# Altium schematic sheet HIC15.SchDoc
size B; Organization: Altium Limited; Address1: L3, 12a Rodborough Rd; Address2: Frenchs Forest; Address3: NSW; Address4: Australia 2086
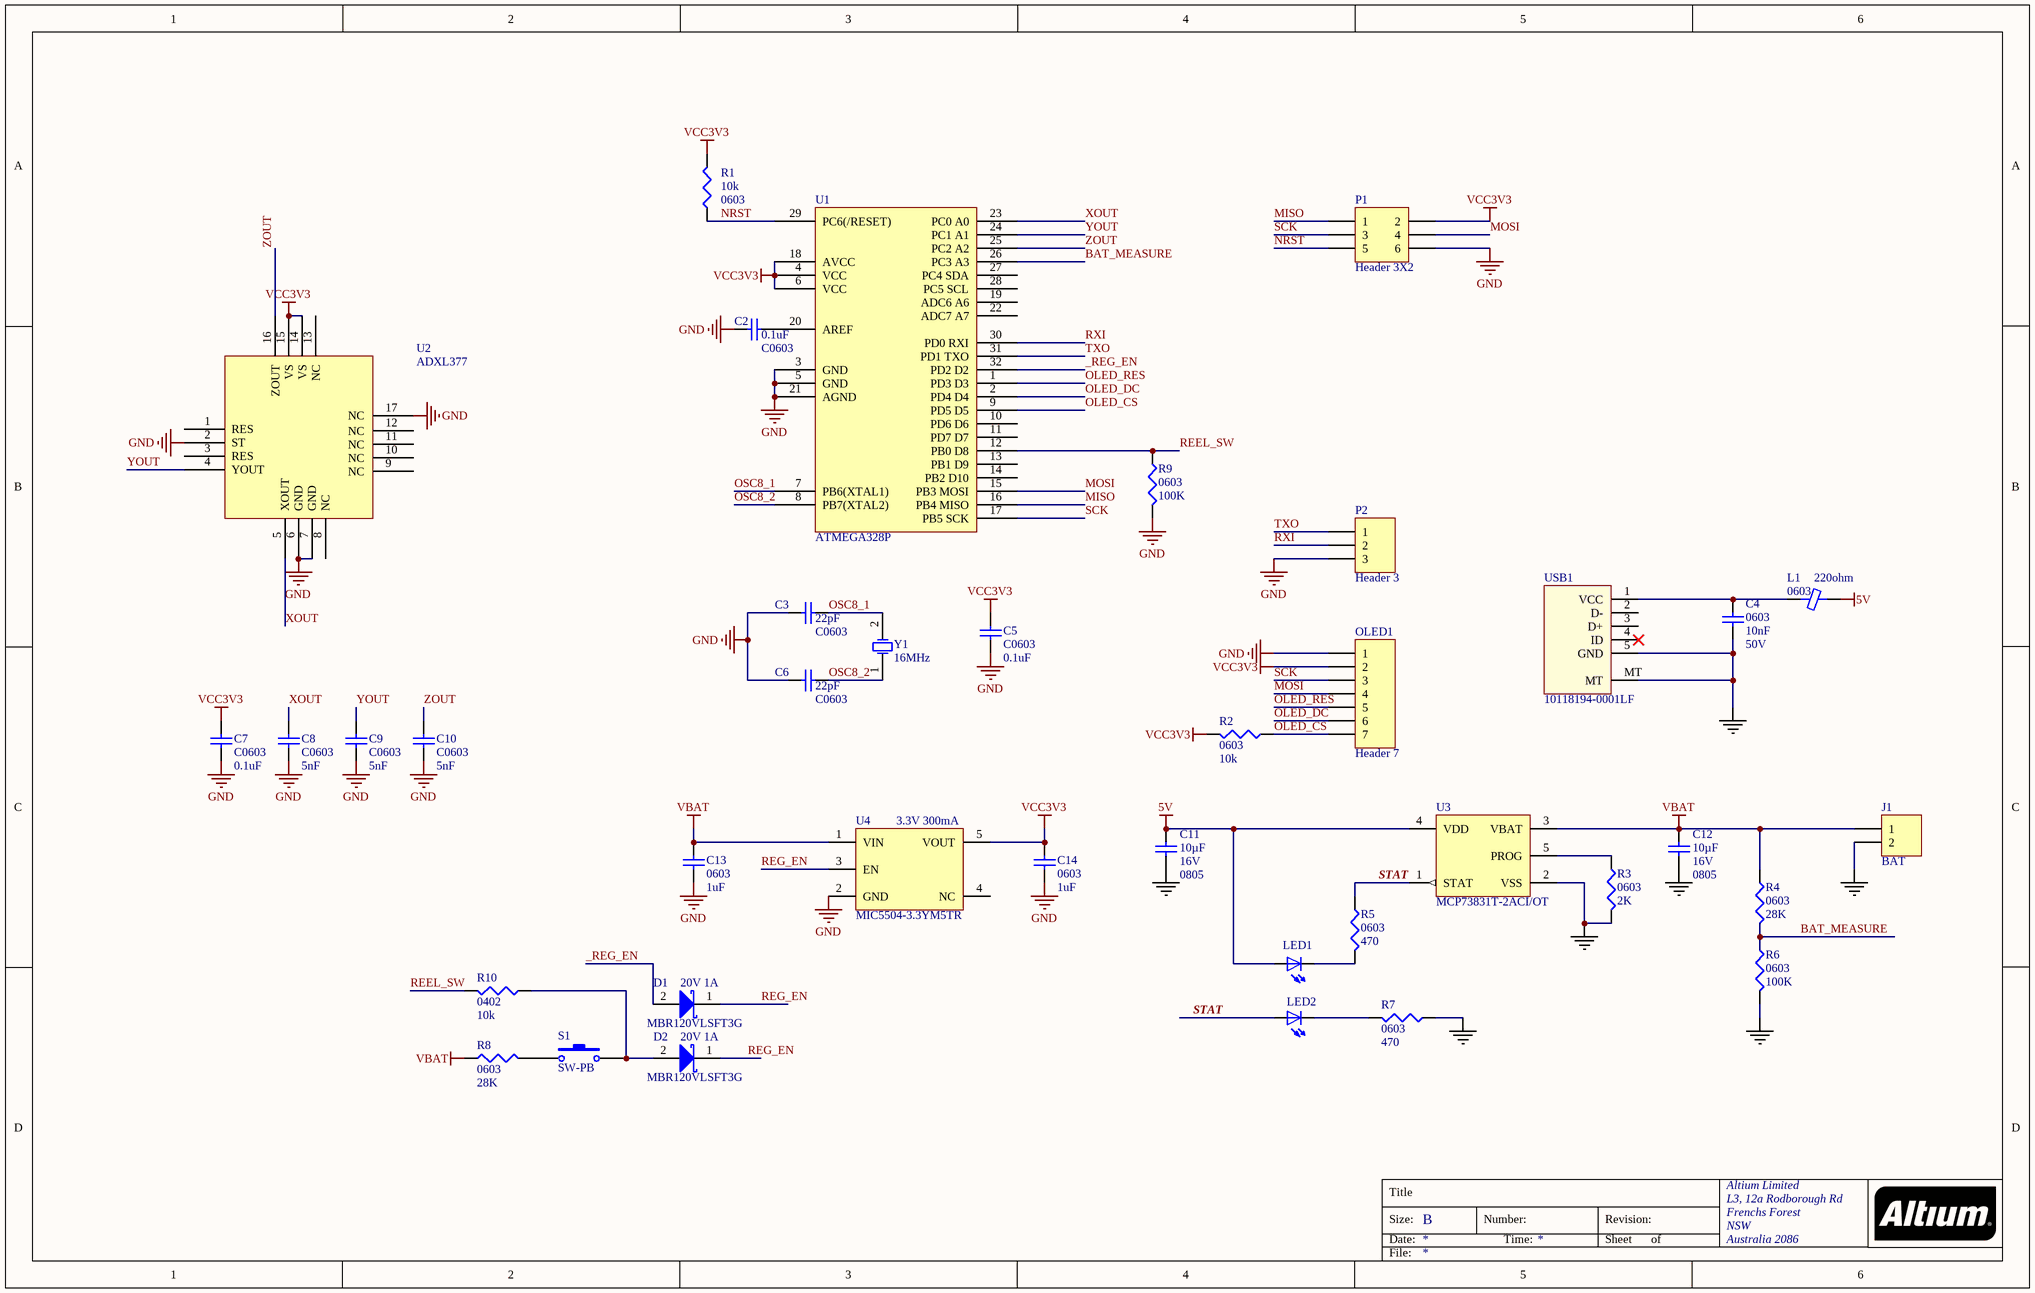
[diagram p0: HIC15.SchDoc]

## Parts
C2  C0603  value 0.1uF  [C0603]
C3  C0603  value 22pF  [C0603]
C4  0603  value 10nF  Voltage Rating: 50V  [C0603]
C5  C0603  value 0.1uF  [C0603]
C6  C0603  value 22pF  [C0603]
C7  C0603  value 0.1uF  [C0603]
C8  C0603  value 5nF  [C0603]
C9  C0603  value 5nF  [C0603]
C10  C0603  value 5nF  [C0603]
C11  0805  value 10µF  Voltage - Rated: 16V  [C0805]
C12  0805  value 10µF  Voltage - Rated: 16V  [C0805]
C13  0603  value 1uF  [C0603]
C14  0603  value 1uF  [C0603]
D1  MBR120VLSFT3G  value 20V 1A  [SOD-123FL]
D2  MBR120VLSFT3G  value 20V 1A  [SOD-123FL]
J1  BAT  [HDR1X2]
L1  0603  value 220ohm  [FER 0603/1608]
LED1  LTST-C190KRKT  [LED-0603-RED]  (value not drawn)
LED2  LTST-C190KGKT  [LED-0603-GREEN]  (value not drawn)
OLED1  Header 7  [CON-7]
P1  Header 3X2  [SPI_PORT]
P2  Header 3  [HDR1X3]
R1  0603  value 10k  [R0603]
R2  0603  value 10k  [R0603]
R3  0603  value 2K  [R0603]
R4  0603  value 28K  [R0603]
R5  0603  value 470  [R0603]
R6  0603  value 100K  [R0603]
R7  0603  value 470  [R0603]
R8  0603  value 28K  [R0603]
R9  0603  value 100K  [R0603]
R10  0402  value 10k  [R0402]
S1  SW-PB  [REED_SWITCH]
U1  ATMEGA328P  [32A-M]
U2  ADXL377  [QFN50P300X300X150_HS-17L]
U3  MCP73831T-2ACI/OT  [SOT23-5]
U4  MIC5504-3.3YM5TR  value 3.3V 300mA  [SOT23-5]
USB1  10118194-0001LF  [10118194-0001LF]
Y1  16MHz  [ABM3]

## Nets
5V: C11.2 L1.1 LED1.A U3.4(VDD)
GND: C2.2 C3.2 C4.1 C5.2 C6.2 C7.2 C8.2 C9.2 C10.2 C11.1 C12.1 C13.1 C14.1 J1.2 OLED1.1 P1.6 P2.3 R3.2 R6.2 R7.1 R9.2 U1.3(GND) U1.5(GND) U1.21(AGND) U2.2(ST) U2.6(GND) U2.7(GND) U2.17(NC) U3.2(VSS) U4.2(GND) USB1.5(GND) USB1.MT
VBAT: C12.2 C13.2 J1.1 R4.1 R8.1 U3.3(VBAT) U4.1(VIN)
VCC3V3: C5.1 C7.1 C14.2 OLED1.2 P1.2 R1.2 R2.2 U1.4(VCC) U1.6(VCC) U1.18(AVCC) U2.14(VS) U2.15(VS) U4.5(VOUT)
_REG_EN: D1.2(K) U1.32(PD2_D2)
BAT_MEASURE: R4.2 R6.1 U1.26(PC3_A3)
MISO: P1.1 U1.16(PB4_MISO)
MOSI: OLED1.4 P1.4 U1.15(PB3_MOSI)
NRST: P1.5 R1.1 U1.29(PC6(/RESET))
OLED_CS: OLED1.7 R2.1 U1.9(PD5_D5)
OLED_DC: OLED1.6 U1.2(PD4_D4)
OLED_RES: OLED1.5 U1.1(PD3_D3)
OSC8_1: C3.1 U1.7(PB6(XTAL1)) Y1.2(OSC2)
OSC8_2: C6.1 U1.8(PB7(XTAL2)) Y1.1(OSC1)
REEL_SW: R9.1 R10.2 U1.12(PB0_D8)
REG_EN: D1.1(A) D2.1(A) U4.3(EN)
RXI: P2.2 U1.30(PD0_RXI)
SCK: OLED1.3 P1.3 U1.17(PB5_SCK)
STAT: LED2.A R5.1 U3.1(STAT)
TXO: P2.1 U1.31(PD1_TXO)
XOUT: C8.1 U1.23(PC0_A0) U2.5(XOUT)
YOUT: C9.1 U1.24(PC1_A1) U2.4(YOUT)
ZOUT: C10.1 U1.25(PC2_A2) U2.16(ZOUT)
NetC2_1: C2.1 U1.20(AREF)
NetC4_2: C4.2 L1.2 USB1.1(VCC)
NetD2_2: D2.2(K) R10.1 S1.2
NetLED1_C: LED1.C R5.2
NetLED2_C: LED2.C R7.2
NetR3_1: R3.1 U3.5(PROG)
NetR8_2: R8.2 S1.1

Not connected (* = marked no-connect by the designer): U1 10(PD6_D6) 11(PD7_D7) 13(PB1_D9) 14(PB2_D10) 19(ADC6_A6) 22(ADC7_A7) 27(PC4_SDA) 28(PC5_SCL); U2 1(RES) 3(RES) 8(NC) 9(NC) 10(NC) 11(NC) 12(NC) 13(NC); U4 4(NC); USB1 2(D-) 3(D+) 4(ID)*

## Notes on the sheet
- Title
- Size:
- Date:
- B
- Number:
- Time:
- Revision:
- Sheet
- of
- File:

## Library data of the parts
C2 C3 C5-C10 = Cap_0603: Capacitor
C4 = Cap Semi: CAP CER 10000PF 50V X7R 0402; Manufacturer: Murata; Manufacturer Part Number: GCM155R71H103KA55D; Tolerance: 10%; ComponentLink1URL: http://www.murata.com/~/media/webrenewal/support/library/catalog/products/capacitor/mlcc/c02e.pdf; ComponentLink1Description: http://www.murata.com/~/media/webrenewal/support/library/catalog/products/capacitor/mlcc/c02e.pdf; ComponentLink2URL: https://datasheet.ciiva.com/16208/cl05b104kq5nnnc-16208343.pdf; ComponentLink2Description: https://datasheet.ciiva.com/16208/cl05b104kq5nnnc-16208343.pdf; ComponentLink3URL: https://datasheet.ciiva.com/26920/getdatasheetpartid-359683-26920169.pdf; ComponentLink3Description: https://datasheet.ciiva.com/26920/getdatasheetpartid-359683-26920169.pdf; ComponentLink4URL: https://datasheet.ciiva.com/26309/mlcc-catalogdownload2013-eng-26309003.pdf; ComponentLink4Description: https://datasheet.ciiva.com/26309/mlcc-catalogdownload2013-eng-26309003.pdf; ComponentLink5URL: https://datasheet.ciiva.com/29198/458718-da-01-en-vs-kondensator-0402-29198423.pdf; ComponentLink5Description: https://datasheet.ciiva.com/29198/458718-da-01-en-vs-kondensator-0402-29198423.pdf; Supplier 1: Digi-Key; Supplier Part Number 1: 490-4762-1-ND; Stock 1: 100000; Pricing 1: 1=0.1, 10=0.048, 100=0.0215, 500=0.01538, 1000=0.01208, 2500=0.01098, 5000=0.0101 (USD); Mount: Surface Mount; Case/Package: 0402; Case Code (Imperial): 0402; Case Code (Metric): 1005; Min Operating Temperature: -55°C; Max Operating Temperature: 125°C; Capacitance: 10nF; Dielectric: X7R; Packaging: Tape and Reel; Package Quantity: 1; Termination: SMD/SMT; Voltage: 50V; Voltage Rating (DC): 50V; Length: 1mm; Height: 0.5mm; Width: 0.02inch; Thickness: 0.022inch; Depth: 0.5mm; Ratings: AEC-Q200; Radiation Hardening: No; REACH SVHC: No SVHC; Lead Free: Lead Free; ComponentLink6URL: https://datasheet.ciiva.com/16199/product-16199584.pdf; ComponentLink6Description: https://datasheet.ciiva.com/16199/product-16199584.pdf; ComponentLink7URL: https://datasheet.ciiva.com/18100/getdatasheetpartid-27433-18100656.pdf; ComponentLink7Description: https://datasheet.ciiva.com/18100/getdatasheetpartid-27433-18100656.pdf; ComponentLink8URL: https://datasheet.ciiva.com/130/product-130682.pdf; ComponentLink8Description: https://datasheet.ciiva.com/130/product-130682.pdf; ComponentLink9URL: https://datasheet.ciiva.com/11787/0900766b80ef92d0-11787082.pdf; ComponentLink9Description: https://datasheet.ciiva.com/11787/0900766b80ef92d0-11787082.pdf; ComponentLink10URL: https://datasheet.ciiva.com/130/product-130683.pdf; ComponentLink10Description: https://datasheet.ciiva.com/130/product-130683.pdf; ComponentLink11URL: https://datasheet.ciiva.com/130/product-130684.pdf; ComponentLink11Description: https://datasheet.ciiva.com/130/product-130684.pdf; ComponentLink12URL: https://datasheet.ciiva.com/2989/product-2989235.pdf; ComponentLink12Description: https://datasheet.ciiva.com/2989/product-2989235.pdf; ComponentLink13URL: https://datasheet.ciiva.com/16624/product-16624550.pdf; ComponentLink13Description: https://datasheet.ciiva.com/16624/product-16624550.pdf
C11 C12 = Cap Semi: CAP CER 10UF 16V X5R 0805; Manufacturer: Murata Electronics North America; Manufacturer Part Number: GRM21BR61C106KE15K; Tolerance: ±10%; Supplier 1: Digi-Key; Supplier Part Number 1: 490-6473-1-ND; RoHS: RoHS Compliant; Category: Capacitors; Stock 1: 129274; Pricing 1: 1=0.19, 10=0.13, 50=0.0748, 100=0.0618, 250=0.052, 500=0.04356, 1000=0.03575, 5000=0.03023 (USD); Packaging: Cut Tape (CT); Capacitance: 10µF; Temperature Coefficient: X5R; Mounting Type: Surface Mount, MLCC; Operating Temperature: -55°C ~ 85°C; Applications: General Purpose; Ratings: -; Package / Case: 0805 (2012 Metric); Size / Dimension: 0.079" L x 0.049" W (2.00mm x 1.25mm); Height - Seated (Max): -; Thickness (Max): 0.053" (1.35mm); Lead Spacing: -; Features: -; Lead Style: -; ComponentLink1URL: http://www.murata.com/~/media/webrenewal/support/library/catalog/products/capacitor/mlcc/c02e.pdf; ComponentLink1Description: http://www.murata.com/~/media/webrenewal/support/library/catalog/products/capacitor/mlcc/c02e.pdf
C13 C14 = Cap: Capacitor; Published: 8-Jun-2000; LatestRevisionDate: 17-Jul-2002; LatestRevisionNote: Re-released for DXP Platform.; PackageReference: RAD-0.3; Publisher: Altium Limited; PackageDescription: Radial Cap, Thru-Hole; 2 Leads; 0.3 in Pin Spacing
D1 D2 = D Schottky: DIODE SCHOTTKY 20V 1A SOD123FL; Manufacturer: ON Semiconductor; Max Surge Current: 45A; Forward Voltage: 340mV; Peak Reverse Current: 600uA; Element Configuration: Single; Polarity: Standard; ComponentLink1URL: http://www.onsemi.com/pub_link/Collateral/MBR0520LT1-D.PDF; ComponentLink1Description: http://www.onsemi.com/pub_link/Collateral/MBR0520LT1-D.PDF; Supplier 1: Digi-Key; Supplier Part Number 1: MBR120VLSFT3GOSCT-ND; Manufacturer Part Number: MBR120VLSFT3G; Stock 1: 46165; Pricing 1: 1=0.42, 10=0.338, 100=0.2298, 500=0.17234, 1000=0.12926 (USD); Number of Pins: 2; Min Operating Temperature: -65°C; Max Operating Temperature: 125°C; Package Quantity: 10000; Forward Current: 1A; Packaging: Tape and Reel; Max Reverse Leakage Current: 600uA; Average Rectified Current: 1A; Peak Non-Repetitive Surge Current: 45A; Max Repetitive Reverse Voltage (Vrrm): 20V; Max Forward Surge Current (Ifsm): 45A; Voltage Rating (DC): 20V; Current Rating: 1A; Output Current: 1A; Max Reverse Voltage (DC): 20V; Radiation Hardening: No; REACH SVHC: No SVHC; Lead Free: Lead Free; Halogen Free: Halogen Free; ComponentLink2URL: https://datasheet.ciiva.com/4715/mbr120vlsft1-d-107081-4715104.pdf; ComponentLink2Description: https://datasheet.ciiva.com/4715/mbr120vlsft1-d-107081-4715104.pdf; ComponentLink3URL: https://datasheet.ciiva.com/6380/mbr120vlsft1-d-6380907.pdf; ComponentLink3Description: https://datasheet.ciiva.com/6380/mbr120vlsft1-d-6380907.pdf; ComponentLink4URL: https://datasheet.ciiva.com/8294/mbr120vlsft1-d-8294603.pdf; ComponentLink4Description: https://datasheet.ciiva.com/8294/mbr120vlsft1-d-8294603.pdf; ComponentLink5URL: https://datasheet.ciiva.com/6380/mbr120vlsft1-d-6380910.pdf; ComponentLink5Description: https://datasheet.ciiva.com/6380/mbr120vlsft1-d-6380910.pdf
J1 = Header 2: Header, 2-Pin; LatestRevisionDate: 17-Jul-2002; LatestRevisionNote: Re-released for DXP Platform.; Publisher: Altium Limited
L1 = Ferrite Chip: FERRITE BEAD 220 OHM 0603 1LN; Manufacturer: Murata; Manufacturer Part Number: BLM18EG221SN1D; Material: Steel,Ferrite; Tolerance: 25%; Impedance: 220R; DC Resistance (DCR): 50mR; Max DC Current: 2A; Number of Lines: 1; Test Frequency: 100MHz; ComponentLink1URL: http://components.arrow.com/part/dataview/0323_06096831; ComponentLink1Description: http://components.arrow.com/part/dataview/0323_06096831; ComponentLink2URL: http://www.murata.com/en-us/products/productdata/8796740354078/QNFA9102.pdf; ComponentLink2Description: http://www.murata.com/en-us/products/productdata/8796740354078/QNFA9102.pdf; ComponentLink3URL: http://search.murata.co.jp/Ceramy/image/img/PDF/ENG/L0132S0193BLM21P.pdf; ComponentLink3Description: http://search.murata.co.jp/Ceramy/image/img/PDF/ENG/L0132S0193BLM21P.pdf; ComponentLink4URL: http://www.mouser.com/ds/2/281/c31e-794748.pdf; ComponentLink4Description: http://www.mouser.com/ds/2/281/c31e-794748.pdf; ComponentLink5URL: https://datasheet.ciiva.com/46634/beads-commercial-power-mpz-en-46634741.pdf; ComponentLink5Description: https://datasheet.ciiva.com/46634/beads-commercial-power-mpz-en-46634741.pdf; ComponentLink6URL: https://datasheet.ciiva.com/46634/beads-commercial-power-mpz-en-46634632.pdf; ComponentLink6Description: https://datasheet.ciiva.com/46634/beads-commercial-power-mpz-en-46634632.pdf; ComponentLink7URL: https://datasheet.ciiva.com/46634/beads-commercial-power-mpz-en-46634712.pdf; ComponentLink7Description: https://datasheet.ciiva.com/46634/beads-commercial-power-mpz-en-46634712.pdf; ComponentLink8URL: https://datasheet.ciiva.com/48682/beads-commercial-power-mpz-en-48682492.pdf; ComponentLink8Description: https://datasheet.ciiva.com/48682/beads-commercial-power-mpz-en-48682492.pdf; Supplier 1: Digi-Key; Supplier Part Number 1: 490-3992-1-ND; Stock 1: 618017; Pricing 1: 1=0.23, 10=0.175, 25=0.1452, 50=0.1252, 100=0.1126, 250=0.09508, 500=0.08508, 1000=0.07257 (USD); Case/Package: 0603; Number of Pins: 2; Core Material: Ferrite; Case Code (Metric): 1608; Case Code (Imperial): 0603; Contact Plating: Tin,Matte; Min Operating Temperature: -55°C; Max Operating Temperature: 125°C; Resistance: 50mR; Package Quantity: 1; Packaging: Tape and Reel; Current Rating: 2A; Max Current Rating: 2A; Termination: SMD/SMT; DC Current: 2A; Military Standard: Not; Frequency: 100MHz; Number of Circuits: 1; Length: 1.6mm; Height: 0.8mm; Width: 0.8mm; Depth: 0.8mm; Radiation Hardening: No; REACH SVHC: No SVHC; Lead Free: Lead Free; ComponentLink9URL: https://datasheet.ciiva.com/11799/0900766b811b5866-11799010.pdf; ComponentLink9Description: https://datasheet.ciiva.com/11799/0900766b811b5866-11799010.pdf; ComponentLink10URL: https://datasheet.ciiva.com/41449/001171699-da-01-en-chip-drossel0603-220r-2000ma-1-6x0-8mm-41449376.pdf; ComponentLink10Description: https://datasheet.ciiva.com/41449/001171699-da-01-en-chip-drossel0603-220r-2000ma-1-6x0-8mm-41449376.pdf; ComponentLink11URL: https://datasheet.ciiva.com/41449/001172265-da-01-en-drossel-0603-220r-1-6x0-8mm-4000st-41449579.pdf; ComponentLink11Description: https://datasheet.ciiva.com/41449/001172265-da-01-en-drossel-0603-220r-1-6x0-8mm-4000st-41449579.pdf; ComponentLink12URL: https://datasheet.ciiva.com/1467/5169-1467157.pdf; ComponentLink12Description: https://datasheet.ciiva.com/1467/5169-1467157.pdf; ComponentLink13URL: https://datasheet.ciiva.com/1467/5169-1467158.pdf; ComponentLink13Description: https://datasheet.ciiva.com/1467/5169-1467158.pdf; ComponentLink14URL: https://datasheet.ciiva.com/1012/l0110s0101blm18e-1012872.pdf; ComponentLink14Description: https://datasheet.ciiva.com/1012/l0110s0101blm18e-1012872.pdf; ComponentLink15URL: https://datasheet.ciiva.com/1012/l0110s0101blm18e-1012873.pdf; ComponentLink15Description: https://datasheet.ciiva.com/1012/l0110s0101blm18e-1012873.pdf; ComponentLink16URL: https://datasheet.ciiva.com/1012/l0110s0101blm18e-1012874.pdf; ComponentLink16Description: https://datasheet.ciiva.com/1012/l0110s0101blm18e-1012874.pdf; ComponentLink17URL: https://datasheet.ciiva.com/8510/l0110s0101blm18e-8510140.pdf; ComponentLink17Description: https://datasheet.ciiva.com/8510/l0110s0101blm18e-8510140.pdf; ComponentLink18URL: https://datasheet.ciiva.com/14122/blm-series-eng-tds-14122908.pdf; ComponentLink18Description: https://datasheet.ciiva.com/14122/blm-series-eng-tds-14122908.pdf; ComponentLink19URL: https://datasheet.ciiva.com/16419/l0110s0101blm18e-16419148.pdf; ComponentLink19Description: https://datasheet.ciiva.com/16419/l0110s0101blm18e-16419148.pdf; ComponentLink20URL: https://datasheet.ciiva.com/17246/l0110s0101blm18e-17246927.pdf; ComponentLink20Description: https://datasheet.ciiva.com/17246/l0110s0101blm18e-17246927.pdf
LED1 = LED0603DWS: LED, GREEN, 0.9MM X 1.1MM, 10MCD, 570NM; Manufacturer: Lite-On Inc.; Color: Red; Lens Color: Colorless; Lens Transparency: Clear; Millicandela Rating: 99mcd; Lens Style/Size: Rectangle with Flat Top, 1.10mm x 0.80mm; Voltage - Forward (Vf) (Typ): 2V; Current - Test: 20mA; Viewing Angle: 130°; Wavelength - Dominant: 631nm; Wavelength - Peak: 639nm; Supplier 1: Digi-Key; Supplier Part Number 1: 160-1436-1-ND; Manufacturer Part Number: LTST-C190KRKT; RoHS: RoHS Compliant; Category: Optoelectronics; Stock 1: 274428; Pricing 1: 1=0.24, 10=0.186, 100=0.1015, 250=0.06768, 500=0.05752, 1000=0.04399 (USD); Packaging: Cut Tape (CT); Mounting Type: Surface Mount; Features: -; Package / Case: 0603 (1608 Metric); Supplier Device Package: *; Size / Dimension: 1.60mm L x 0.80mm W; Height (Max): 0.80mm; ComponentLink1URL: http://optoelectronics.liteon.com/upload/download/DS-22-99-0151/S_110_LTST-C190KRKT.pdf; ComponentLink1Description: http://optoelectronics.liteon.com/upload/download/DS-22-99-0151/S_110_LTST-C190KRKT.pdf
LED2 = LED0603DWS: LED GREEN CLEAR 0603 SMD; Manufacturer: Lite-On Inc.; Lens Color: Colorless; Millicandela Rating: 35mcd; Lens Style/Size: Rectangle with Flat Top, 1.10mm x 0.80mm; Voltage - Forward (Vf) (Typ): 2V; Current - Test: 20mA; Viewing Angle: 130°; Wavelength - Dominant: 571nm; Wavelength - Peak: 574nm; Supplier 1: Digi-Key; Supplier Part Number 1: 160-1435-1-ND; Manufacturer Part Number: LTST-C190KGKT; RoHS: RoHS Compliant; Category: Optoelectronics; Stock 1: 777009; Pricing 1: 1=0.27, 10=0.196, 25=0.1448, 100=0.1034, 250=0.07032, 500=0.06204, 1000=0.0486 (USD); Packaging: Cut Tape (CT); Part Status: Active; Color: Green; Lens Transparency: Clear; Mounting Type: Surface Mount; Features: -; Package / Case: 0603 (1608 Metric); Supplier Device Package: *; Size / Dimension: 1.60mm L x 0.80mm W; Height (Max): 0.80mm; ComponentLink1URL: http://optoelectronics.liteon.com/upload/download/DS22-2000-074/S_110_LTST-C190KGKT.pdf; ComponentLink1Description: http://optoelectronics.liteon.com/upload/download/DS22-2000-074/S_110_LTST-C190KGKT.pdf
OLED1 = Header 7: Header, 7-Pin; LatestRevisionDate: 17-Jul-2002; LatestRevisionNote: Re-released for DXP Platform.; Publisher: Altium Limited
P1 = Header 3X2: Header, 3-Pin, Dual row; LatestRevisionDate: 17-Jul-2002; LatestRevisionNote: Re-released for DXP Platform.; Publisher: Altium Limited
P2 = Header 3: Header, 3-Pin; LatestRevisionDate: 17-Jul-2002; LatestRevisionNote: Re-released for DXP Platform.; Publisher: Altium Limited
R1-R10 = Res3: Resistor
S1 = SW-PB: Switch; Published: 24-Mar-1999; LatestRevisionDate: 17-Jul-2002; LatestRevisionNote: Re-released for DXP Platform.; PackageReference: SPST-2; Publisher: Altium Limited; PackageDescription: Switch; 2 Leads
U1 = ATMEGA328P_AU
U3 = MCP73831T-2ACI/OT: IC CONTROLLR LI-ION 4.2V SOT23-5; Manufacturer: Microchip Technology; Battery Chemistry: Lithium-Ion/Polymer; Number of Cells: 1; Current - Charging: Constant - Programmable; Programmable Features: Current; Fault Protection: Over Voltage; Charge Current - Max: 500mA; Voltage - Supply (Max): 6V; Supplier 1: Digi-Key; Supplier Part Number 1: MCP73831T-2ACI/OTCT-ND; Manufacturer Part Number: MCP73831T-2ACI/OT; RoHS: RoHS Compliant; Category: Integrated Circuits (ICs); Stock 1: 18101; Pricing 1: 1=0.58, 25=0.484, 100=0.4326 (USD); Packaging: Cut Tape (CT); Part Status: Active; Battery Pack Voltage: 4.2V; Interface: -; Operating Temperature: -40°C ~ 85°C (TA); Package / Case: SC-74A, SOT-753; Supplier Device Package: SOT-23-5; ComponentLink1URL: http://www.microchip.com/mymicrochip/filehandler.aspx?ddocname=en025112; ComponentLink1Description: http://www.microchip.com/mymicrochip/filehandler.aspx?ddocname=en025112
U4 = MIC5504-3.3YM5TR: IC REG LINEAR 3.3V 300MA SOT23-5; Manufacturer: Microchip Micrel; Min Input Voltage: 2.5V; Max Input Voltage: 5.5V; Dropout Voltage: 380mV; Number of Outputs: 1; Quiescent Current: 38uA; Accuracy: 3%; Operating Supply Current: 42uA; Power Supply Rejection Ratio (PSRR): 60dB; ComponentLink1URL: http://www.diodes.com/_files/datasheets/AP2204.pdf; ComponentLink1Description: http://www.diodes.com/_files/datasheets/AP2204.pdf; Supplier 1: Digi-Key; Manufacturer Part Number: MIC5504-3.3YM5TR; Stock 1: 128319; Pricing 1: 1=0.11, 25=0.0928 (USD); Mount: Surface Mount; Case/Package: SOT-23-5; Number of Pins: 5; Min Operating Temperature: -40°C; Max Operating Temperature: 125°C; Output Current: 300mA; Nominal Output Voltage: 3.3V; Packaging: Tape and Reel; Output Voltage: 3.3V; Max Output Current: 300mA; Length: 2.9mm; Height: 1.1mm; Width: 1.6mm; REACH SVHC: No SVHC; ComponentLink2URL: https://datasheet.ciiva.com/46425/1856860-46425639.pdf; ComponentLink2Description: https://datasheet.ciiva.com/46425/1856860-46425639.pdf; Supplier Part Number 1: 576-4764-1-ND
USB1 = 1050170001: CONN USB MICRO B RECPT SMT R/A; Manufacturer: Amphenol FCI; Gender: Receptacle; Current Rating: 1.8A; Connector Type: USB,Receptacle; Number of Contacts: 5; Insulation Resistance: 1GR; Number of Ports: 1; Max Voltage Rating (AC): 100V; Pitch: 0.65mm; ComponentLink1URL: http://portal.fciconnect.com/Comergent//fci/drawing/10118194.pdf; ComponentLink1Description: http://portal.fciconnect.com/Comergent//fci/drawing/10118194.pdf; Supplier 1: Digi-Key; Supplier Part Number 1: 609-4618-1-ND; Manufacturer Part Number: 10118194-0001LF; Stock 1: 183871; Pricing 1: 1=0.5, 10=0.464, 25=0.418, 50=0.3716, 100=0.3561, 250=0.32516, 500=0.30966 (USD); Mount: Surface Mount,Horizontal; Colour: Black; Contact Material: Copper Alloy; Contact Plating: Gold; Number of Terminals: 5; Housing Material: Polymer; Min Operating Temperature: -55°C; Max Operating Temperature: 85°C; Package Quantity: 9600; Packaging: Tape and Reel; Termination: Solder; Orientation: Right Angle; Features: Shielded; Length: 8.05mm; Depth: 5mm; Radiation Hardening: No; Lead Free: Lead Free; Flammability Rating: UL94 V-0; ComponentLink2URL: https://datasheet.ciiva.com/4598/10118194ac-197217-4598807.pdf; ComponentLink2Description: https://datasheet.ciiva.com/4598/10118194ac-197217-4598807.pdf; ComponentLink3URL: https://datasheet.ciiva.com/29907/10118194-29907230.pdf; ComponentLink3Description: https://datasheet.ciiva.com/29907/10118194-29907230.pdf; ComponentLink4URL: https://datasheet.ciiva.com/26945/getdatasheetpartid-418619-26945695.pdf; ComponentLink4Description: https://datasheet.ciiva.com/26945/getdatasheetpartid-418619-26945695.pdf; ComponentLink5URL: https://datasheet.ciiva.com/851/10118194-851110.pdf; ComponentLink5Description: https://datasheet.ciiva.com/851/10118194-851110.pdf; ComponentLink6URL: https://datasheet.ciiva.com/851/10118194-851111.pdf; ComponentLink6Description: https://datasheet.ciiva.com/851/10118194-851111.pdf
Y1 = XTAL: Crystal Oscillator